# Altium schematic sheet ESP32 with USBC.SchDoc (part 3 of 3)
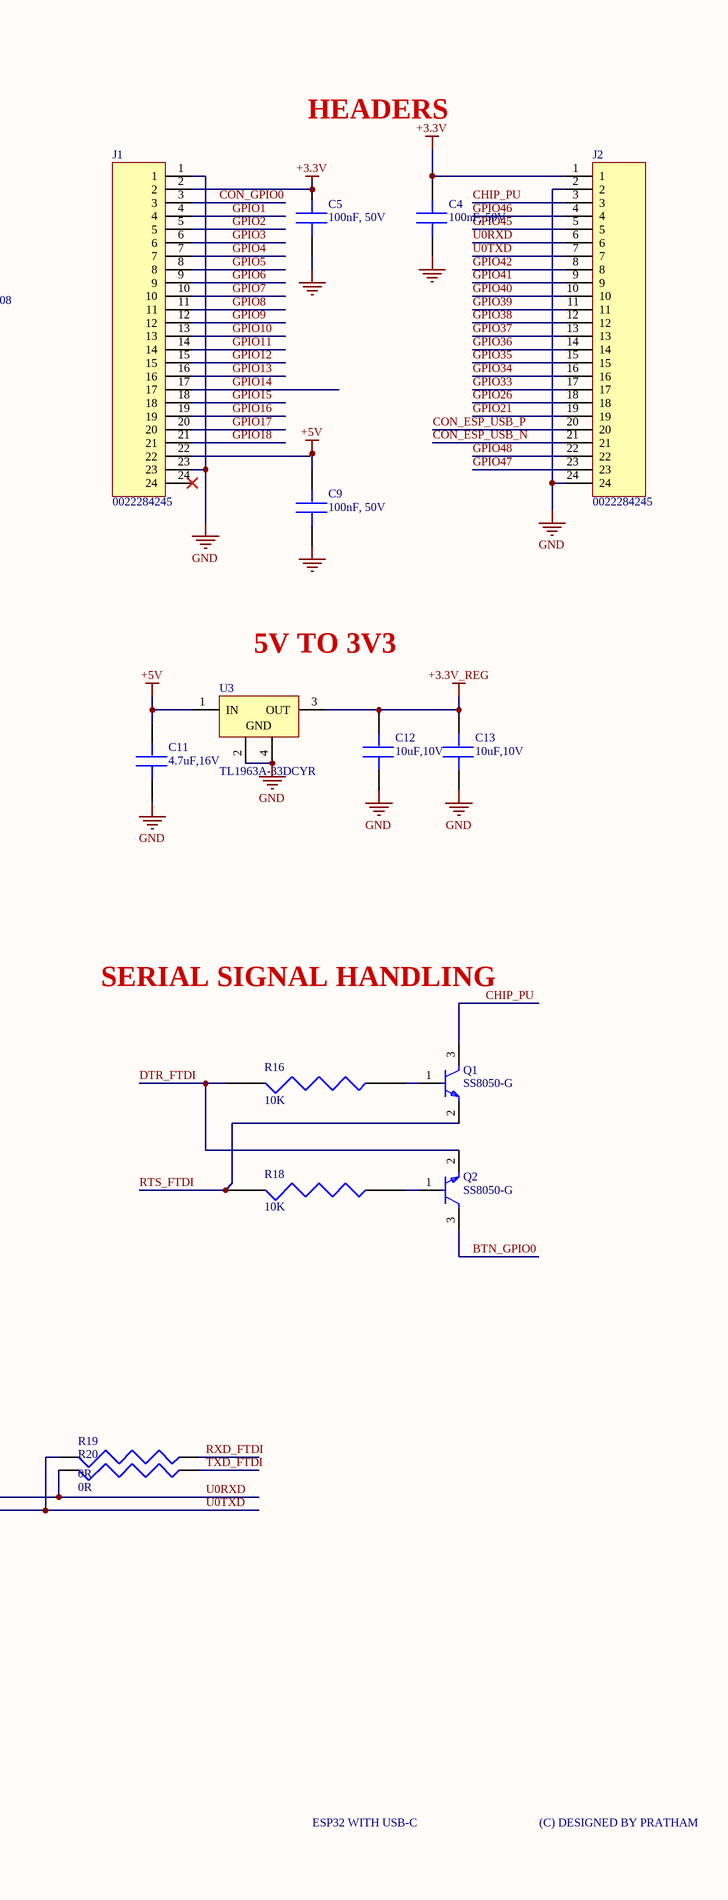
[diagram p3: ESP32 with USBC.SchDoc, right]

## Library data of the parts (continued)
R9 R13 R16-R18 = AC0402FR-0710KL: RES SMD 10K OHM 1% 1/16W 0402; Manufacturer: Yageo Group; Max Power Dissipation: 63mW; Power Rating: 62.5mW; Value: 10kΩ; Temperature Coefficient: 100ppm/°C; Voltage Rating: 50V; Supplier: DigiKey; Supplier Part Number: YAG3436CT-ND; Manufacturer Part Number: AC0402FR-0710KL; RoHS: Compliant; Category: Chip SMD Resistors; Stock: 2629040; Pricing: 1=0.1, 10=0.024, 25=0.0176, 50=0.014, 100=0.0114, 250=0.00876, 500=0.00726, 1000=0.00612, 5000=0.00431 (USD); Case/Package: 0402; Case Code (Imperial): 0402; Case Code (Metric): 1005; China RoHS: Non-Compliant; Composition: Thick Film; Country of Origin: Mainland China, Taiwan; Depth: 500µm; Export Control Classification Number (ECCN) Code: EAR99; Features: Automotive AEC-Q200, Moisture Resistant; Height: 320µm; Harmonized Tariff Schedule (HTS) Code: 8533.21.00.30; Introduction Date: 2012-04-10; Lead Free: Lead Free; Length: 1mm; Lifecycle Status: Production; Max Operating Temperature: 155°C; Military Standard: Not; Min Operating Temperature: -55°C; Mounting Technology: Surface Mount; Number of Terminals: 2; Number of Terminations: 2; Packaging: Tape & Reel; Ratings: AEC-Q200; REACH SVHC: Yes; Schedule B: 8533210045, 8533210045|8533210045|8533210045|8533210045|8533210045|8533210045|8533210045|8533210045|8533210045|8533210045|8533210045|8533210045|8533210045|8533210045|8533210045|8533210045|8533210045|8533210045|8533210045, 8533210045|8533210045|8533210045|8533210045|8533210045|8533210045|8533210045|8533210045|8533210045|8533210045|8533210045|8533210045|8533210045|8533210045|8533210045|8533210045|8533210045|8533210045|8533210045|8533210045|8533210045|8533210045|8533210045|85; Termination: SMD/SMT; Tolerance: 1%; Width: 500µm; Working Voltage: 50V; ComponentLink1URL: https://datasheet.octopart.com:443/AC0402FR-0710KL-Yageo-datasheet-182189377.pdf?src-supplier=IHS; ComponentLink1Description: https://datasheet.octopart.com:443/AC0402FR-0710KL-Yageo-datasheet-182189377.pdf?src-supplier=IHS; ComponentLink2URL: https://datasheet.octopart.com:443/AC0402FR-0710KL-Yageo-datasheet-83209224.pdf?src-supplier=Upverter; ComponentLink2Description: https://datasheet.octopart.com:443/AC0402FR-0710KL-Yageo-datasheet-83209224.pdf?src-supplier=Upverter; ComponentLink3URL: https://datasheet.octopart.com:443/AC0402FR-0710KL-Yageo-datasheet-178509465.pdf?src-supplier=Newark; ComponentLink3Description: https://datasheet.octopart.com:443/AC0402FR-0710KL-Yageo-datasheet-178509465.pdf?src-supplier=Newark; ComponentLink4URL: https://datasheet.octopart.com:443/AC0402FR-0710KL-Yageo-datasheet-166720450.pdf?src-supplier=JRH+Electronics; ComponentLink4Description: https://datasheet.octopart.com:443/AC0402FR-0710KL-Yageo-datasheet-166720450.pdf?src-supplier=JRH+Electronics; ComponentLink5URL: https://datasheet.octopart.com:443/AC0402FR-0710KL-Yageo-datasheet-151884373.pdf?src-supplier=Future+Electronics; ComponentLink5Description: https://datasheet.octopart.com:443/AC0402FR-0710KL-Yageo-datasheet-151884373.pdf?src-supplier=Future+Electronics; ComponentLink6URL: https://datasheet.octopart.com:443/AC0402FR-0710KL-Yageo-Group-datasheet-189830439.pdf?src-supplier=Future+Electronics; ComponentLink6Description: https://datasheet.octopart.com:443/AC0402FR-0710KL-Yageo-Group-datasheet-189830439.pdf?src-supplier=Future+Electronics; ComponentLink7URL: https://datasheet.octopart.com:443/AC0402FR-0710KL-Yageo-datasheet-137699919.pdf?src-supplier=Future+Electronics; ComponentLink7Description: https://datasheet.octopart.com:443/AC0402FR-0710KL-Yageo-datasheet-137699919.pdf?src-supplier=Future+Electronics; ComponentLink8URL: https://datasheet.octopart.com:443/AC0402FR-0710KL-Yageo-datasheet-24580492.pdf?src-supplier=Future+Electronics; ComponentLink8Description: https://datasheet.octopart.com:443/AC0402FR-0710KL-Yageo-datasheet-24580492.pdf?src-supplier=Future+Electronics; ComponentLink9URL: https://datasheet.octopart.com:443/AC0402FR-0710KL-Yageo-datasheet-13029202.pdf?src-supplier=Future+Electronics; ComponentLink9Description: https://datasheet.octopart.com:443/AC0402FR-0710KL-Yageo-datasheet-13029202.pdf?src-supplier=Future+Electronics; ComponentLink10URL: https://datasheet.octopart.com/AC0402FR-0710KL-Yageo-datasheet-12512238.pdf; ComponentLink10Description: https://datasheet.octopart.com/AC0402FR-0710KL-Yageo-datasheet-12512238.pdf; ComponentLink11URL: https://datasheet.octopart.com:443/AC0402FR-0710KL-Yageo-Group-datasheet-164768995.pdf?src-supplier=ODG+(Origin+Data+Global); ComponentLink11Description: https://datasheet.octopart.com:443/AC0402FR-0710KL-Yageo-Group-datasheet-164768995.pdf?src-supplier=ODG+(Origin+Data+Global); ComponentLink12URL: https://datasheet.octopart.com:443/AC0402FR-0710KL-Yageo-datasheet-128677448.pdf?src-supplier=X-ON; ComponentLink12Description: https://datasheet.octopart.com:443/AC0402FR-0710KL-Yageo-datasheet-128677448.pdf?src-supplier=X-ON; ComponentLink13URL: http://sigma.octopart.com:80/conflict_mineral_statement/Yageo-company-3.pdf?src-supplier=Compliance+Statements; ComponentLink13Description: http://sigma.octopart.com:80/conflict_mineral_statement/Yageo-company-3.pdf?src-supplier=Compliance+Statements; ComponentLink14URL: http://sigma.octopart.com:80/rohs_statement/Yageo-company-2.pdf?src-supplier=Compliance+Statements; ComponentLink14Description: http://sigma.octopart.com:80/rohs_statement/Yageo-company-2.pdf?src-supplier=Compliance+Statements; LCSC Part Number: C144807
R10 = RC0402FR-074K7L: RES 4.7K OHM 1% 1/16W 0402; Manufacturer: Yageo Group; Power Rating: 62.5mW; Value: 4.7kΩ; Temperature Coefficient: 100ppm/°C; Voltage Rating: 50V; Supplier: Future Electronics; Supplier Part Number: RC0402FR-074K7L; Manufacturer Part Number: RC0402FR-074K7L; RoHS: Compliant; Category: Chip SMD Resistors; Stock: 1020000; Pricing: 10000=0.0019, 40000=0.0018, 200000=0.0017, 400000=0.0017, 1250000=0.0016 (USD); Case/Package: 0402; Case Code (Imperial): 0402; Case Code (Metric): 1005; China RoHS: Non-Compliant; Composition: Thick Film; Country of Origin: Mainland China, Taiwan; Depth: 500µm; Export Control Classification Number (ECCN) Code: EAR99; Height: 350µm; Harmonized Tariff Schedule (HTS) Code: 8533.21.00.30; Introduction Date: 2008-07-18; Lead Free: Lead Free; Length: 1mm; Lifecycle Status: Production; Max Operating Temperature: 155°C; Military Standard: Not; Min Operating Temperature: -55°C; Mounting Technology: Surface Mount; Pins: 2; Number of Terminals: 2; Packaging: Tape & Reel; REACH SVHC: Yes; Schedule B: 8533210045, 8533210045|8533210045, 8533210045|8533210045|8533210045, 8533210045|8533210045|8533210045|8533210045; Termination: SMD/SMT; Tolerance: 1%; Voltage Rating (AC): 50V; Voltage Rating (DC): 50V; Width: 500µm; Working Voltage: 50V; ComponentLink1URL: https://datasheet.octopart.com:443/RC0402FR-074K7L-Yageo-datasheet-175887523.pdf?src-supplier=IHS; ComponentLink1Description: https://datasheet.octopart.com:443/RC0402FR-074K7L-Yageo-datasheet-175887523.pdf?src-supplier=IHS; ComponentLink2URL: https://datasheet.octopart.com:443/RC0402FR-074K7L-Yageo-datasheet-103092701.pdf?src-supplier=Upverter; ComponentLink2Description: https://datasheet.octopart.com:443/RC0402FR-074K7L-Yageo-datasheet-103092701.pdf?src-supplier=Upverter; ComponentLink3URL: https://datasheet.octopart.com:443/RC0402FR-074K7L-Yageo-datasheet-98239111.pdf?src-supplier=Upverter; ComponentLink3Description: https://datasheet.octopart.com:443/RC0402FR-074K7L-Yageo-datasheet-98239111.pdf?src-supplier=Upverter; ComponentLink4URL: https://datasheet.octopart.com:443/RC0402FR-074K7L-Yageo-Group-datasheet-190305687.pdf?src-supplier=Future+Electronics; ComponentLink4Description: https://datasheet.octopart.com:443/RC0402FR-074K7L-Yageo-Group-datasheet-190305687.pdf?src-supplier=Future+Electronics; ComponentLink5URL: https://datasheet.octopart.com:443/RC0402FR-074K7L-Yageo-datasheet-164759695.pdf?src-supplier=Future+Electronics; ComponentLink5Description: https://datasheet.octopart.com:443/RC0402FR-074K7L-Yageo-datasheet-164759695.pdf?src-supplier=Future+Electronics; ComponentLink6URL: https://datasheet.octopart.com:443/RC0402FR-074K7L-Yageo-datasheet-137700087.pdf?src-supplier=Future+Electronics; ComponentLink6Description: https://datasheet.octopart.com:443/RC0402FR-074K7L-Yageo-datasheet-137700087.pdf?src-supplier=Future+Electronics; ComponentLink7URL: https://datasheet.octopart.com:443/RC0402FR-074K7L-Yageo-Group-datasheet-190051977.pdf?src-supplier=Newark; ComponentLink7Description: https://datasheet.octopart.com:443/RC0402FR-074K7L-Yageo-Group-datasheet-190051977.pdf?src-supplier=Newark; ComponentLink8URL: https://datasheet.octopart.com:443/RC0402FR-074K7L-Yageo-datasheet-12531192.pdf?src-supplier=Newark; ComponentLink8Description: https://datasheet.octopart.com:443/RC0402FR-074K7L-Yageo-datasheet-12531192.pdf?src-supplier=Newark; ComponentLink9URL: https://datasheet.octopart.com:443/RC0402FR-074K7L-Yageo-datasheet-8324527.pdf?src-supplier=Newark; ComponentLink9Description: https://datasheet.octopart.com:443/RC0402FR-074K7L-Yageo-datasheet-8324527.pdf?src-supplier=Newark; ComponentLink10URL: https://datasheet.octopart.com:443/RC0402FR-074K7L-Yageo-datasheet-10408619.pdf?src-supplier=element14+APAC; ComponentLink10Description: https://datasheet.octopart.com:443/RC0402FR-074K7L-Yageo-datasheet-10408619.pdf?src-supplier=element14+APAC; ComponentLink11URL: https://datasheet.octopart.com:443/RC0402FR-074K7L-Yageo-datasheet-13691069.pdf?src-supplier=element14+APAC; ComponentLink11Description: https://datasheet.octopart.com:443/RC0402FR-074K7L-Yageo-datasheet-13691069.pdf?src-supplier=element14+APAC; ComponentLink12URL: https://datasheet.octopart.com:443/RC0402FR-074K7L-Yageo-datasheet-62067350.pdf?src-supplier=Farnell; ComponentLink12Description: https://datasheet.octopart.com:443/RC0402FR-074K7L-Yageo-datasheet-62067350.pdf?src-supplier=Farnell; ComponentLink13URL: https://datasheet.octopart.com:443/RC0402FR-074K7L-Yageo-datasheet-8329306.pdf?src-supplier=element14; ComponentLink13Description: https://datasheet.octopart.com:443/RC0402FR-074K7L-Yageo-datasheet-8329306.pdf?src-supplier=element14; ComponentLink14URL: https://datasheet.octopart.com:443/RC0402FR-074K7L-Yageo-Group-datasheet-189192902.pdf?src-supplier=LCSC; ComponentLink14Description: https://datasheet.octopart.com:443/RC0402FR-074K7L-Yageo-Group-datasheet-189192902.pdf?src-supplier=LCSC; ComponentLink15URL: https://datasheet.octopart.com:443/RC0402FR-074K7L-Yageo-datasheet-175423674.pdf?src-supplier=SOS+electronic; ComponentLink15Description: https://datasheet.octopart.com:443/RC0402FR-074K7L-Yageo-datasheet-175423674.pdf?src-supplier=SOS+electronic; ComponentLink16URL: https://datasheet.octopart.com:443/RC0402FR-074K7L-Yageo-datasheet-79472498.pdf?src-supplier=Megastar; ComponentLink16Description: https://datasheet.octopart.com:443/RC0402FR-074K7L-Yageo-datasheet-79472498.pdf?src-supplier=Megastar; ComponentLink17URL: https://datasheet.octopart.com/RC0402FR-074K7L-Yageo-datasheet-73766026.pdf; ComponentLink17Description: https://datasheet.octopart.com/RC0402FR-074K7L-Yageo-datasheet-73766026.pdf; ComponentLink18URL: http://sigma.octopart.com:80/conflict_mineral_statement/Yageo-company-3.pdf?src-supplier=Compliance+Statements; ComponentLink18Description: http://sigma.octopart.com:80/conflict_mineral_statement/Yageo-company-3.pdf?src-supplier=Compliance+Statements; ComponentLink19URL: http://sigma.octopart.com:80/rohs_statement/Yageo-company-2.pdf?src-supplier=Compliance+Statements; ComponentLink19Description: http://sigma.octopart.com:80/rohs_statement/Yageo-company-2.pdf?src-supplier=Compliance+Statements; LCSC Part Number: C105871
R11 R12 R14 R15 = AC0402FR-7W5K1L: RES 5.1K OHM 1% 1/8W 0402; Manufacturer: Yageo Group; Power Rating: 125mW; Value: 5.1kΩ; Temperature Coefficient: 100ppm/°C; Voltage Rating: 50V; Working Voltage: 75V; Supplier: Future Electronics; Supplier Part Number: AC0402FR-7W5K1L; Manufacturer Part Number: AC0402FR-7W5K1L; RoHS: Compliant; Category: Chip SMD Resistors; Stock: 150000; Pricing: 10000=0.0068, 30000=0.0066, 50000=0.0065, 100000=0.0064, 200000=0.0062 (USD); Case/Package: 0402; China RoHS: Non-Compliant; Composition: Thick Film; Height: 320µm; Length: 1mm; Lifecycle Status: Production; Max Operating Temperature: 155°C; Min Operating Temperature: -55°C; Mounting Technology: Surface Mount; Number of Terminals: 2; Packaging: Tape & Reel; Ratings: AEC-Q200; REACH SVHC: Yes; Tolerance: 1%; Width: 500µm; ComponentLink1URL: https://datasheet.octopart.com:443/AC0402FR-7W5K1L-Yageo-datasheet-182189377.pdf?src-supplier=IHS; ComponentLink1Description: https://datasheet.octopart.com:443/AC0402FR-7W5K1L-Yageo-datasheet-182189377.pdf?src-supplier=IHS; ComponentLink2URL: https://datasheet.octopart.com:443/AC0402FR-7W5K1L-Yageo-datasheet-83209224.pdf?src-supplier=Upverter; ComponentLink2Description: https://datasheet.octopart.com:443/AC0402FR-7W5K1L-Yageo-datasheet-83209224.pdf?src-supplier=Upverter; ComponentLink3URL: https://datasheet.octopart.com:443/AC0402FR-7W5K1L-Yageo-datasheet-178509465.pdf?src-supplier=Farnell; ComponentLink3Description: https://datasheet.octopart.com:443/AC0402FR-7W5K1L-Yageo-datasheet-178509465.pdf?src-supplier=Farnell; ComponentLink4URL: https://datasheet.octopart.com:443/AC0402FR-7W5K1L-Yageo-Group-datasheet-188689268.pdf?src-supplier=LCSC; ComponentLink4Description: https://datasheet.octopart.com:443/AC0402FR-7W5K1L-Yageo-Group-datasheet-188689268.pdf?src-supplier=LCSC; ComponentLink5URL: https://datasheet.octopart.com:443/AC0402FR-7W5K1L-Yageo-datasheet-166720450.pdf?src-supplier=Future+Electronics; ComponentLink5Description: https://datasheet.octopart.com:443/AC0402FR-7W5K1L-Yageo-datasheet-166720450.pdf?src-supplier=Future+Electronics; ComponentLink6URL: https://datasheet.octopart.com:443/AC0402FR-7W5K1L-Yageo-datasheet-151884373.pdf?src-supplier=Future+Electronics; ComponentLink6Description: https://datasheet.octopart.com:443/AC0402FR-7W5K1L-Yageo-datasheet-151884373.pdf?src-supplier=Future+Electronics; ComponentLink7URL: https://datasheet.octopart.com/AC0402FR-7W5K1L-Yageo-datasheet-12512238.pdf; ComponentLink7Description: https://datasheet.octopart.com/AC0402FR-7W5K1L-Yageo-datasheet-12512238.pdf; ComponentLink8URL: http://sigma.octopart.com:80/conflict_mineral_statement/Yageo-company-3.pdf?src-supplier=Compliance+Statements; ComponentLink8Description: http://sigma.octopart.com:80/conflict_mineral_statement/Yageo-company-3.pdf?src-supplier=Compliance+Statements; ComponentLink9URL: http://sigma.octopart.com:80/rohs_statement/Yageo-company-2.pdf?src-supplier=Compliance+Statements; ComponentLink9Description: http://sigma.octopart.com:80/rohs_statement/Yageo-company-2.pdf?src-supplier=Compliance+Statements; LCSC Part Number: C20141810
SW1 SW2 = PTS645SH50SMTR92LFS: SWITCH TACTILE SPST-NO 0.05A 12V; Manufacturer: C&K Components; Actuator Material: Nylon, Polyamide; Contact Current Rating: 50mA; Contact Resistance: 100mΩ; Electrical Life: 100kcycles; Illumination Type: Illuminated, Non-Illuminated; Insulation Resistance: 100GΩ; Number of Positions: 1; Operating Force: 1.96N; Switch Function: Off-Mom; Throw Configuration: SPST; Supplier: DigiKey; Supplier Part Number: CKN9085DKR-ND; Manufacturer Part Number: PTS645SH50SMTR92LFS; RoHS: Compliant; Category: Tactile Switches; Stock: 42157; Pricing: 1=0.39, 10=0.34, 25=0.318, 100=0.2845, 250=0.26364, 500=0.2488 (USD); Case/Package: SMD/SMT; Color: Black; Contact Material: Bronze; Contact Plating: Silver; Country of Origin: Mainland China; Current Rating: 50mA; Depth: 9mm; Export Control Classification Number (ECCN) Code: EAR99; Height: 3.4544mm; Harmonized Tariff Schedule (HTS) Code: 8536.50.90.40; Introduction Date: 2013-05-01; Lead Free: Lead Free; Length: 6mm; Life (Cycles): 100kcycles; Lifecycle Status: Production; Max Current Rating: 50mA; Max Operating Temperature: 60°C; Max Voltage Rating (DC): 12V; Mechanical Life: 100kcycles; Min Operating Temperature: -20°C; Mounting Technology: Surface Mount; Orientation: Straight; Packaging: Tape & Reel (TR); REACH SVHC: Yes; Termination: Solder; Voltage Rating (DC): 12V; ComponentLink1URL: https://datasheet.octopart.com:443/PTS645SH50SMTR92LFS-C%26K-Components-datasheet-169841344.pdf?src-supplier=Farnell; ComponentLink1Description: https://datasheet.octopart.com:443/PTS645SH50SMTR92LFS-C%26K-Components-datasheet-169841344.pdf?src-supplier=Farnell; ComponentLink2URL: https://datasheet.octopart.com:443/PTS645SH50SMTR92LFS-C%26K-Components-datasheet-165782998.pdf?src-supplier=Farnell; ComponentLink2Description: https://datasheet.octopart.com:443/PTS645SH50SMTR92LFS-C%26K-Components-datasheet-165782998.pdf?src-supplier=Farnell; ComponentLink3URL: https://datasheet.octopart.com:443/PTS645SH50SMTR92LFS-C%26K-Components-datasheet-67873720.pdf?src-supplier=Upverter; ComponentLink3Description: https://datasheet.octopart.com:443/PTS645SH50SMTR92LFS-C%26K-Components-datasheet-67873720.pdf?src-supplier=Upverter; ComponentLink4URL: https://datasheet.octopart.com:443/PTS645SH50SMTR92-LFS-C%26K-Components-datasheet-141421486.pdf?src-supplier=Upverter; ComponentLink4Description: https://datasheet.octopart.com:443/PTS645SH50SMTR92-LFS-C%26K-Components-datasheet-141421486.pdf?src-supplier=Upverter; ComponentLink5URL: https://datasheet.octopart.com:443/PTS645SH50SMTR92-LFS-C%26K-Components-datasheet-110647872.pdf?src-supplier=TME; ComponentLink5Description: https://datasheet.octopart.com:443/PTS645SH50SMTR92-LFS-C%26K-Components-datasheet-110647872.pdf?src-supplier=TME; ComponentLink6URL: https://datasheet.octopart.com:443/PTS645SH50SMTR-92-LFS-C%26K-Components-datasheet-150821959.pdf?src-supplier=TME; ComponentLink6Description: https://datasheet.octopart.com:443/PTS645SH50SMTR-92-LFS-C%26K-Components-datasheet-150821959.pdf?src-supplier=TME; ComponentLink7URL: https://datasheet.octopart.com:443/PTS645SH50SMTR92LFS-C%26K-Components-datasheet-138128951.pdf?src-supplier=Future+Electronics; ComponentLink7Description: https://datasheet.octopart.com:443/PTS645SH50SMTR92LFS-C%26K-Components-datasheet-138128951.pdf?src-supplier=Future+Electronics; ComponentLink8URL: https://datasheet.octopart.com:443/PTS645SH50SMTR92LFS-C%26K-Components-datasheet-62111174.pdf?src-supplier=Future+Electronics; ComponentLink8Description: https://datasheet.octopart.com:443/PTS645SH50SMTR92LFS-C%26K-Components-datasheet-62111174.pdf?src-supplier=Future+Electronics; ComponentLink9URL: https://datasheet.octopart.com:443/PTS645SH50SMTR92LFS-C%26K-Components-datasheet-24578962.pdf?src-supplier=Future+Electronics; ComponentLink9Description: https://datasheet.octopart.com:443/PTS645SH50SMTR92LFS-C%26K-Components-datasheet-24578962.pdf?src-supplier=Future+Electronics; ComponentLink10URL: https://datasheet.octopart.com:443/PTS645SH50SMTR92-LFS-C%26K-Components-datasheet-12590747.pdf?src-supplier=Future+Electronics; ComponentLink10Description: https://datasheet.octopart.com:443/PTS645SH50SMTR92-LFS-C%26K-Components-datasheet-12590747.pdf?src-supplier=Future+Electronics; LCSC Part Number: C221869
U1 = ESP32-S3-MINI-1-N8: SMD module, ESP32-S3FN8, 8 MB SPI flash, PCB antenna; Manufacturer: Espressif Systems; Supplier: DigiKey; Supplier Part Number: 5407-ESP32-S3-MINI-1-N8CT-ND; Manufacturer Part Number: ESP32-S3-MINI-1-N8; RoHS: Compliant; Category: RF Transceiver Modules and Modems; Stock: 7053; Pricing: 1=5.43, 10=4.703, 25=4.4492, 100=4.0995, 250=3.89008 (USD); ComponentLink1URL: https://datasheet.octopart.com:443/ESP32-S3-MINI-1-N8-Espressif-Systems-datasheet-194171672.pdf?src-supplier=LCSC; ComponentLink1Description: https://datasheet.octopart.com:443/ESP32-S3-MINI-1-N8-Espressif-Systems-datasheet-194171672.pdf?src-supplier=LCSC; ComponentLink2URL: https://datasheet.octopart.com:443/ESP32-S3-MINI-1-N8-Espressif-Systems-datasheet-188867343.pdf?src-supplier=TME; ComponentLink2Description: https://datasheet.octopart.com:443/ESP32-S3-MINI-1-N8-Espressif-Systems-datasheet-188867343.pdf?src-supplier=TME; ComponentLink3URL: https://datasheet.octopart.com:443/ESP32-S3-MINI-1-N8-Espressif-Systems-datasheet-165560562.pdf?src-supplier=TME; ComponentLink3Description: https://datasheet.octopart.com:443/ESP32-S3-MINI-1-N8-Espressif-Systems-datasheet-165560562.pdf?src-supplier=TME; ComponentLink4URL: https://datasheet.octopart.com:443/ESP32-S3-MINI-1-N8-Espressif-Systems-datasheet-165560559.pdf?src-supplier=TME; ComponentLink4Description: https://datasheet.octopart.com:443/ESP32-S3-MINI-1-N8-Espressif-Systems-datasheet-165560559.pdf?src-supplier=TME; ComponentLink5URL: https://datasheet.octopart.com:443/ESP32-S3-MINI-1-N8-Espressif-Systems-datasheet-192318068.pdf?src-supplier=HQonline; ComponentLink5Description: https://datasheet.octopart.com:443/ESP32-S3-MINI-1-N8-Espressif-Systems-datasheet-192318068.pdf?src-supplier=HQonline; LCSCPart Number: C2913206
U2 = FT231XQ-R: IC USB SERIAL FULL UART 20QFN; Manufacturer: FTDI; Data Rate: 12Mbps; Interface: UART, USB; Clock Frequency: 12.02MHz; Max Supply Current: 8.4mA; Max Supply Voltage: 5.5V; Min Supply Voltage: 2.97V; Nominal Supply Voltage (DC): 5V; Number of Channels: 1; Operating Supply Current: 8mA; Supplier: DigiKey; Supplier Part Number: 768-1128-6-ND; Manufacturer Part Number: FT231XQ-R; RoHS: Compliant; Category: UART Interface ICs; Pricing: 1=2.34, 25=2.27, 100=2.2, 250=2.15728 (USD); Ambient Temperature Range High: 85°C; Case/Package: QFN; Height: 800µm; Height - Seated (Max): 800µm; Lead Free: Lead Free; Length: 4mm; Lifecycle Status: Production; Max Operating Temperature: 85°C; Min Operating Temperature: -40°C; Mounting Technology: Surface Mount; Pins: 20; Number of Terminals: 20; REACH SVHC: Yes; Terminal Pitch: 500µm; Weight: 123.008581mg; Width: 4mm; ComponentLink1URL: https://datasheet.octopart.com:443/FT231XQ-R-FTDI-datasheet-182343132.pdf?src-supplier=IHS; ComponentLink1Description: https://datasheet.octopart.com:443/FT231XQ-R-FTDI-datasheet-182343132.pdf?src-supplier=IHS; ComponentLink2URL: https://datasheet.octopart.com:443/FT231XQ-R-FTDI-datasheet-11021087.pdf?src-supplier=HQonline; ComponentLink2Description: https://datasheet.octopart.com:443/FT231XQ-R-FTDI-datasheet-11021087.pdf?src-supplier=HQonline; ComponentLink3URL: https://datasheet.octopart.com:443/FT231XQ-R-FTDI-datasheet-28834672.pdf?src-supplier=SOS+electronic; ComponentLink3Description: https://datasheet.octopart.com:443/FT231XQ-R-FTDI-datasheet-28834672.pdf?src-supplier=SOS+electronic; ComponentLink4URL: https://datasheet.octopart.com:443/FT231XQ-R-FTDI-datasheet-68321328.pdf?src-supplier=TME; ComponentLink4Description: https://datasheet.octopart.com:443/FT231XQ-R-FTDI-datasheet-68321328.pdf?src-supplier=TME; ComponentLink5URL: https://datasheet.octopart.com:443/FT231XQ-R-FTDI-datasheet-134530624.pdf?src-supplier=SHENGYU+ELECTRONICS; ComponentLink5Description: https://datasheet.octopart.com:443/FT231XQ-R-FTDI-datasheet-134530624.pdf?src-supplier=SHENGYU+ELECTRONICS; LCSC Part Number: C132159
U3 = TL1963A-33DCYR: IC REG LIN 3.3V 1.5A SOT-223-4; Manufacturer: Texas Instruments; Manufacturer Lifecycle Status: ACTIVE; Accuracy: 3%; Dropout Voltage: 340mV; Input Bias Current: 1mA; Max Supply Voltage: 20V; Min Current Limit: 1.6A; Min Input Voltage: 2.1V; Number of Outputs: 1; Output Type: Fixed; Polarity: Positive; Supplier: DigiKey; Supplier Part Number: 296-24897-6-ND; Manufacturer Part Number: TL1963A-33DCYR; RoHS: Compliant; Category: LDO Voltage Regulators; Stock: 8580; Pricing: 1=3.65, 10=2.748, 25=2.522, 100=2.274, 250=2.15568, 500=2.13436 (USD); Case/Package: SOT-223; Contact Plating: Tin; Height: 1.8mm; Lead Free: Lead Free; Length: 6.5mm; Lifecycle Status: Production; Max Operating Temperature: 125°C; Max Output current: 1.5A; Max Output Voltage: 3.3V; Min Operating Temperature: -40°C; Min Output Voltage: 3.3V; Nominal Output Voltage: 3.3V; Pins: 4; Number of Regulators: 1; Output Current: 1.5A; Output Voltage: 3.3V; Quiescent Current: 1mA; Radiation Hardening: No; REACH SVHC: No; Schedule B: 8542390000, 8542390000|8542390000|8542390000|8542390000|8542390000; Thickness: 1.6mm; Width: 3.5mm; ComponentLink1URL: https://datasheet.octopart.com:443/TL1963A-33DCYR-Texas-Instruments-datasheet-36835243.pdf?src-supplier=Texas+Instruments; ComponentLink1Description: https://datasheet.octopart.com:443/TL1963A-33DCYR-Texas-Instruments-datasheet-36835243.pdf?src-supplier=Texas+Instruments; ComponentLink2URL: https://octopart.com:443/opatz8j6/c1?t=BB3_hJL8Et4eClcf6GC8-iyWa3qj3AeGWjMwvlCubTCytAYX_WVx4vgEqHtaoOY00UnrGZBu4o1UKHcdXhq7rF6dq3n_zdK8h-Y27i1JH5jAN-gaJeqWR4nfR-e5NnK2s6ZDC4qi4h9CqDg-3bCkR1TQCUvu0KW3MyCrbJHKMXSoZXKjzjO-ZZvKdNAX931iTpKzsFvpnCDVyyyyIdz9-xoPAYmUBm8uTLJHVuBfuQPSv-jRtRxQDKHadH6beD7dLgmtCN8_Y_k0kMkuhJ1eVHfsKYzUNZlgbayM4puoAyWpfH2VQ9IGRgiwRNRPCXDkV5cNmqD3Tj3uvQYEfhWEoA6N1eZzsolV6VI19mAdBtJqPzp5KQVzc3beLDqJs6eDF4ZNjHU&src-supplier=Texas+Instruments; ComponentLink2Description: https://octopart.com:443/opatz8j6/c1?t=BB3_hJL8Et4eClcf6GC8-iyWa3qj3AeGWjMwvlCubTCytAYX_WVx4vgEqHtaoOY00UnrGZBu4o1UKHcdXhq7rF6dq3n_zdK8h-Y27i1JH5jAN-gaJeqWR4nfR-e5NnK2s6ZDC4qi4h9CqDg-3bCkR1TQCUvu0KW3MyCrbJHKMXSoZXKjzjO-ZZvKdNAX931iTpKzsFvpnCDVyyyyIdz9-xoPAYmUBm8uTLJHVuBfuQPSv-jRtRxQDKHadH6beD7dLgmtCN8_Y_k0kMkuhJ1eVHfsKYzUNZlgbayM4puoAyWpfH2VQ9IGRgiwRNRPCXDkV5cNmqD3Tj3uvQYEfhWEoA6N1eZzsolV6VI19mAdBtJqPzp5KQVzc3beLDqJs6eDF4ZNjHU&src-supplier=Texas+Instruments; ComponentLink3URL: https://datasheet.octopart.com:443/TL1963A-33DCYR-Texas-Instruments-datasheet-10255270.pdf?src-supplier=Texas+Instruments; ComponentLink3Description: https://datasheet.octopart.com:443/TL1963A-33DCYR-Texas-Instruments-datasheet-10255270.pdf?src-supplier=Texas+Instruments; ComponentLink4URL: https://sigma.octopart.com:443/49253063/technical_drawing/Texas-Instruments-TL1963A-33DCYR.pdf?src-supplier=Texas+Instruments; ComponentLink4Description: https://sigma.octopart.com:443/49253063/technical_drawing/Texas-Instruments-TL1963A-33DCYR.pdf?src-supplier=Texas+Instruments; ComponentLink5URL: https://datasheet.octopart.com:443/TL1963A-33DCYR-Texas-Instruments-datasheet-159117591.pdf?src-supplier=Augswan; ComponentLink5Description: https://datasheet.octopart.com:443/TL1963A-33DCYR-Texas-Instruments-datasheet-159117591.pdf?src-supplier=Augswan; ComponentLink6URL: https://datasheet.octopart.com:443/TL1963A-33DCYR-Texas-Instruments-datasheet-21820479.pdf?src-supplier=Newark; ComponentLink6Description: https://datasheet.octopart.com:443/TL1963A-33DCYR-Texas-Instruments-datasheet-21820479.pdf?src-supplier=Newark; ComponentLink7URL: https://datasheet.octopart.com:443/TL1963A-33DCYR-Texas-Instruments-datasheet-16079880.pdf?src-supplier=Farnell; ComponentLink7Description: https://datasheet.octopart.com:443/TL1963A-33DCYR-Texas-Instruments-datasheet-16079880.pdf?src-supplier=Farnell; ComponentLink8URL: https://datasheet.octopart.com:443/TL1963A-33DCYR-Texas-Instruments-datasheet-14171511.pdf?src-supplier=iiiC; ComponentLink8Description: https://datasheet.octopart.com:443/TL1963A-33DCYR-Texas-Instruments-datasheet-14171511.pdf?src-supplier=iiiC; ComponentLink9URL: http://sigma.octopart.com:80/reach_statement/Texas-Instruments-company-64.pdf?src-supplier=Compliance+Statements; ComponentLink9Description: http://sigma.octopart.com:80/reach_statement/Texas-Instruments-company-64.pdf?src-supplier=Compliance+Statements; ComponentLink10URL: http://sigma.octopart.com:80/conflict_mineral_statement/Texas-Instruments-company-63.pdf?src-supplier=Compliance+Statements; ComponentLink10Description: http://sigma.octopart.com:80/conflict_mineral_statement/Texas-Instruments-company-63.pdf?src-supplier=Compliance+Statements; LCSC Part Number: C181262